# Altium schematic sheet power.SchDoc: Test
size A4; DrawnBy: Łukasz Przeniosło; Organization: Zachodniopomorski; Address1: Uniwersytet Technologiczny; Address2: w Szczecinie; Address3: Wydział Elektryczny; DocumentNumber: 8; Revision: 1.0; SheetNumber: 8; SheetTotal: 8
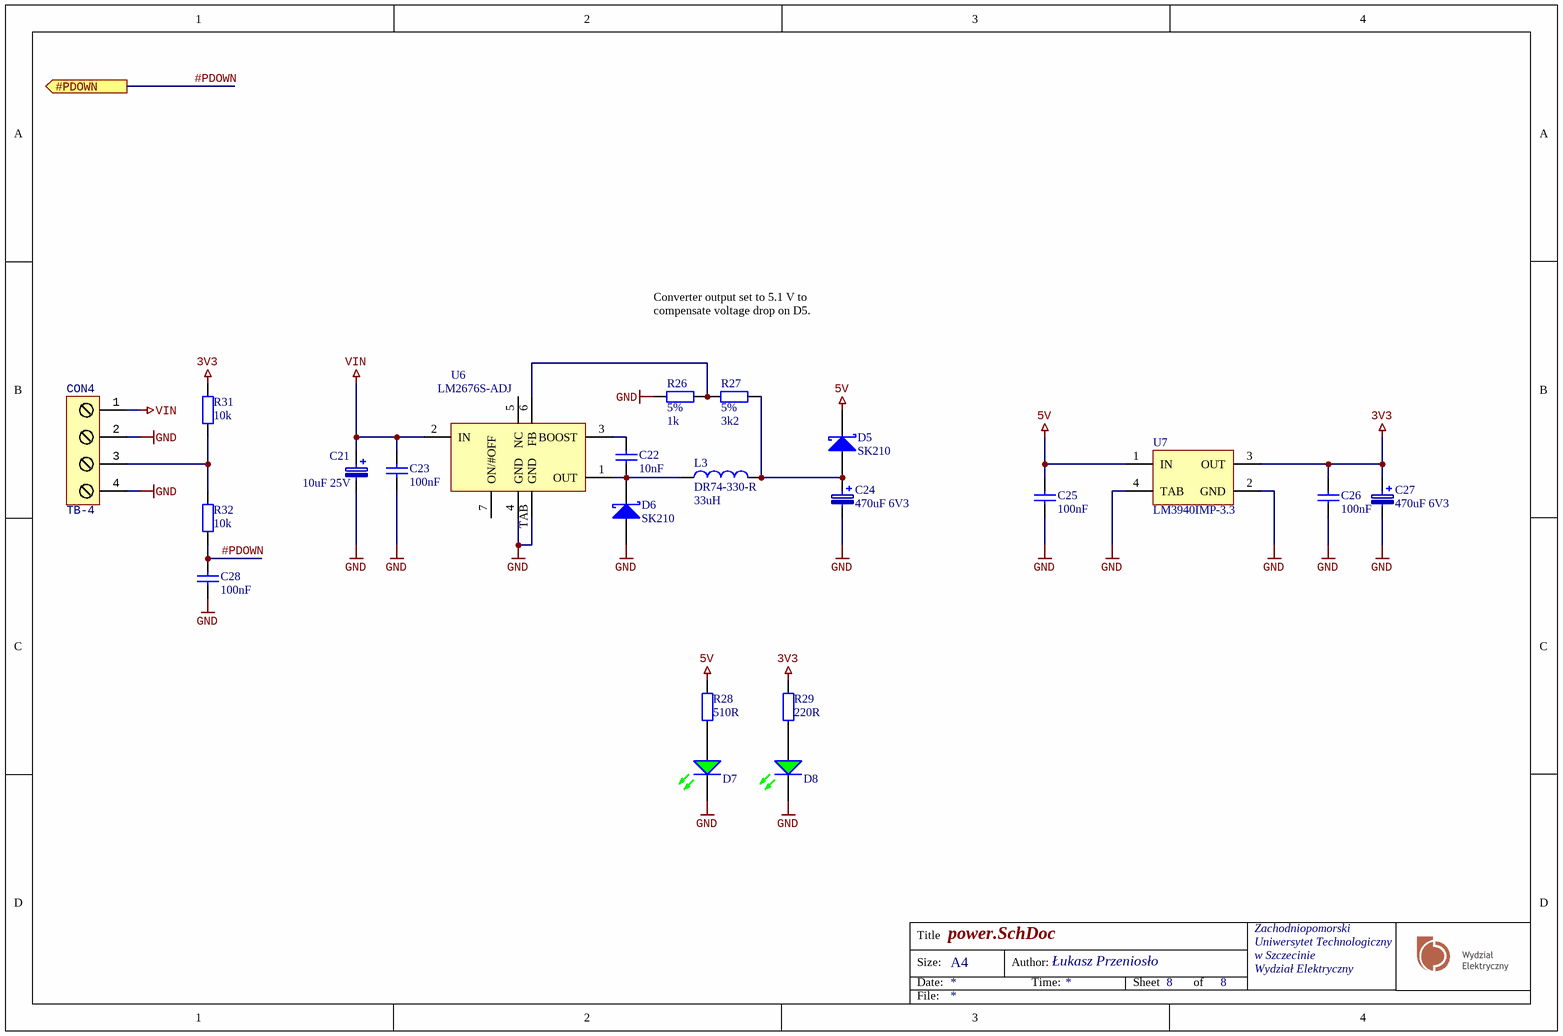
[diagram p0: power.SchDoc]

## Parts
C21  10uF 25V  [SMDB]
C22  10nF  [CAPC1608N]
C23  100nF  [CAPC1608N]
C24  470uF 6V3  [SMDD]
C25  100nF  [CAPC1608N]
C26  100nF  [CAPC1608N]
C27  470uF 6V3  [SMDD]
C28  100nF  [CAPC1608N]
CON4  TB-4  [Terminal-block-4way-2.54]
D5  SK210  [SMB]
D6  SK210  [SMB]
D7  LL-S172GC-2A  [CD2012-0805]  (value not drawn)
D8  LL-S172GC-2A  [CD2012-0805]  (value not drawn)
L3  DR74-330-R  value 33uH  [DR74 Series]
R26  Tolerance: 5%  [RESC1608N]  (hidden comment: 1k)
R27  Tolerance: 5%  [RESC1608N]  (hidden comment: 3k2)
R28  510R  [RESC1608N]
R29  220R  [RESC1608N]
R31  10k  [RESC1608N]
R32  10k  [RESC1608N]
U6  LM2676S-ADJ  [TO-263-7]
U7  LM3940IMP-3.3  [MP04A_N]

## Ports
#PDOWN (out)

## Nets
3V3: C26.2 C27.1 R29.1 R31.1 U7.3(OUT)
5V: C25.2 D5.2(K) R28.1 U7.1(IN)
GND: C21.2 C23.1 C24.2 C25.1 C26.1 C27.2 C28.1 CON4.2 CON4.4 D6.1(A) D7.2(K) D8.2(K) R26.1 U6.4(GND) U6.TAB(GND) U7.2(GND) U7.4(TAB)
VIN: C21.1 C23.2 CON4.1 U6.2(IN)
#PDOWN: C28.2 R32.2 ; port #PDOWN
NetC22_1: C22.1 D6.2(K) L3.1 U6.1(OUT)
NetC22_2: C22.2 U6.3(BOOST)
NetC24_1: C24.1 D5.1(A) L3.2 R27.2
NetCON4_3: CON4.3 R31.2 R32.1
NetD7_1: D7.1(A) R28.2
NetD8_1: D8.1(A) R29.2
NetR26_2: R26.2 R27.1 U6.6(FB)

Not connected (* = marked no-connect by the designer): U6 5(NC) 7(ON/#OFF)

## Notes on the sheet
- Converter output set to 5.1 V to compensate voltage drop on D5.
- Title
- Size:
- Date:
- A4
- Author:
- Time:
- Sheet
- of
- File:

## Library data of the parts
C21 = Capacitor Tantalum: Value: 10uF 25V
C22 C23 C28 = Capacitor
  C22: Value: 10nF
  C23 C28: Value: 100nF
C24 C27 = 10uF 35V-SMDD: Polarized Capacitor (Surface Mount); Value: 10uF; PackageReference: SMDD; Manufacturer: *; Manufacturer Part No.: *; Distributor: tme.pl; Distributor Order Code: TC 10/35-SMDD; tme.pl: TC 10/35-SMDD
C25 C26 = Cap: Capacitor; Published: 8-Jun-2000; LatestRevisionDate: 17-Jul-2002; LatestRevisionNote: Re-released for DXP Platform.; Publisher: Altium Limited
CON4 = Terminal Block 4
D5 D6 = MBRS340T3: Schottky Barrier Rectifier,  40V, 3A; PackageReference: SMC; Distributor: *; Distributor Order Code: *; Manufacturer Part No.: *; tme.pl: MBRS340T3
D7 D8 = Led Green: Typical GREEN LED; Manufacturer: Lucky Light; Value: LL-S172GC-2A
L3 = DR74-330-R: elfa.se: 58-101-14; Published: 8-Jun-2000; PackageDocument: Sep-1998; Publisher: Altium Limited; ComponentLink1Description: Manufacturer Link; ComponentLink2Description: Datasheet; Distributor: tme.pl
R26 R27 = Resistor: Power: 0W
  R26: Value: 1k
  R27: Value: 3k2
R28 R29 R31 R32 = Resistor: Tolerance: 5%; Power: 0W
  R28: Value: 510R
  R29: Value: 220R
  R31 R32: Value: 10k
U6 = LM2676S-ADJ: SIMPLE SWITCHER High Efficiency 3A Step-Down Voltage Regulator; elfa.se: 73-068-81; ComponentLink1Description: Manufacturer Link; ComponentLink1URL: http://www.national.com/; ComponentLink2Description: Datasheet; ComponentLink2URL: http://www.national.com/ds.cgi/LM/LM2676.pdf; Distributor: tme.pl
U7 = LM3940IMP-3.3: 1A Low Dropout Regulator for 5V to 3.3V Conversion, 4-pin SOT-223; Manufacturer: National Semiconductor; PackageTopMarking: XYTT*L52B; PowerWise: N; CompType: LDO IC; Published: 4-Dec-2008; DatasheetVersion: Jul-2007; PackageVersion: revB, Apr-2003; PackageReference: MP04A; Publisher: Altium Limited; PackageDescription: Molded SOT-223, 6.50 x 3.56 x 1.6mm Body, 4 Lead, 2.3mm Pitch; Supplier 1: Farnell; Supplier Part Number 1: 9779280; PartNumber: LM3940IMP-3.3; RoHS: N; PinCount: 4; Code_JEDEC: TO-261-AA; Code_IPC: SOT223-4; ComponentLink1Description: LM3940 Datasheet; ComponentLink1URL: http://www.national.com/ds/LM/LM3940.pdf; ComponentLink2Description: LM3940 Web Page; ComponentLink2URL: http://www.national.com/pf/LM/LM3940.html; ComponentLink3Description: MP04A Package Page; ComponentLink3URL: http://www.national.com/packaging/folders/mp04a.html